# Altium project DUCKF4 V2 - small.PrjPcb
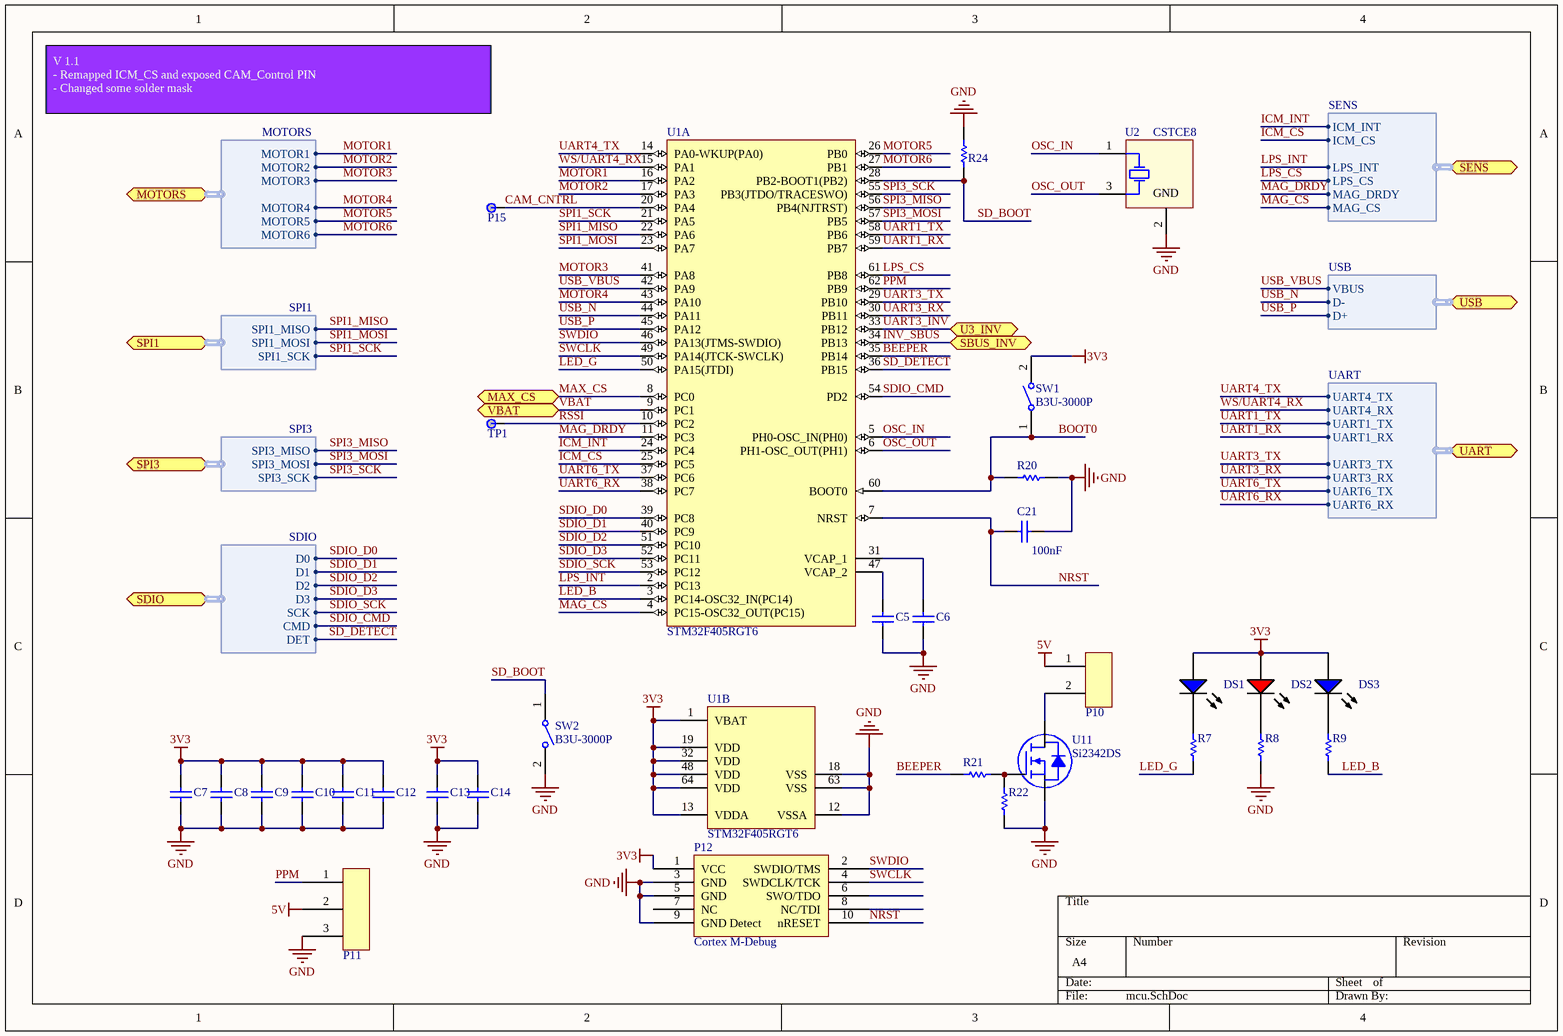
[diagram p0: mcu.SchDoc]
6 sheets, 116 parts. Net scope: flat (ports and power ports of the same name join across sheets).
Sheets:
  mcu.SchDoc
  mems.SchDoc
  powersupply.SchDoc
  connectors.SchDoc
  usd.SchDoc
  osd.SchDoc

## Sheet mcu.SchDoc
size A4

### Parts
C5  CAP 2.2uF 6.3V 0603(1608)  [CAPC0603(1608)100_L]  (value not drawn)
C6  CAP 2.2uF 6.3V 0603(1608)  [CAPC0603(1608)100_L]  (value not drawn)
C7  CAP 100nF 35V 0402(1005)  [CAPC0402(1005)60_L]  (value not drawn)
C8  CAP 100nF 35V 0402(1005)  [CAPC0402(1005)60_L]  (value not drawn)
C9  CAP 100nF 35V 0402(1005)  [CAPC0402(1005)60_L]  (value not drawn)
C10  CAP 100nF 35V 0402(1005)  [CAPC0402(1005)60_L]  (value not drawn)
C11  CAP 100nF 35V 0402(1005)  [CAPC0402(1005)60_L]  (value not drawn)
C12  CAP 4.7uF 6.3V 0603(1608)  [CAPC0603(1608)100_M]  (value not drawn)
C13  CAP 1uF 6.3V 0603(1608)  [CAPC0603(1608)100_N]  (value not drawn)
C14  CAP 10nF 35V 0402(1005)  [CAPC0402(1005)60_M]  (value not drawn)
C21  value 100nF  [CAPC0402(1005)60_L]  (hidden comment: CAP 100nF 35V 0402(1005))
DS1  TLMB1100-GS08  [VISH-TLMX1100-2_V]  (value not drawn)
DS2  TLMS1100-GS08  [VISH-TLMX1100_V]  (value not drawn)
DS3  TLMB1100-GS08  [VISH-TLMX1100-2_V]  (value not drawn)
P10  2 Pads  [2Pads]  (value not drawn)
P11  3 Pads  [3Pads]  (value not drawn)
P12  Cortex M-Debug  [FTSH-105-01-XXX-DV-K]
P15  1Pads  [1PADS]  (value not drawn)  (no BOM)
R7  1K 5% 0402(1005)  [RESC0402(1005)_L]  (value not drawn)
R8  1K 5% 0402(1005)  [RESC0402(1005)_L]  (value not drawn)
R9  1K 5% 0402(1005)  [RESC0402(1005)_L]  (value not drawn)
R20  100K 5% 0402(1005)  [RESC0402(1005)_L]  (value not drawn)
R21  200R 5% 0402(1005)  [RESC0402(1005)_N]  (value not drawn)
R22  110K 5% 0402(1005)  [RESC0402(1005)_L]  (value not drawn)
R24  47K 5% 0402(1005)  [RESC0402(1005)_M]  (value not drawn)
SW1  B3U-3000P  [OMRON-B3U-3000P_V]
SW2  B3U-3000P  [OMRON-B3U-3000P_V]
TP1  Test Point  [TP]  (value not drawn)
U1  STM32F405RGT6  [STM-LQFP64_M]  (parts A,B of 2)
U2  CSTCE8  [MURA-CSTCE_V-3_V]
U11  Si2342DS  [SOT23-3]

### Ports
MAX_CS, MOTORS (harness MOTORS), SBUS_INV, SDIO (harness SDIO), SENS (harness SENS), SPI1 (harness SPI1), SPI3 (harness SPI3), U3_INV, UART (harness UART), USB (harness USB), VBAT

### Harnesses
MOTORS: MOTOR1, MOTOR2, MOTOR3, MOTOR4, MOTOR5, MOTOR6
SPI1: SPI1_MISO, SPI1_MOSI, SPI1_SCK
SPI3: SPI3_MISO, SPI3_MOSI, SPI3_SCK
SDIO: D0, D1, D2, D3, SCK, CMD, DET
USB: VBUS, D-, D+
UART: UART4_TX, UART4_RX, UART1_TX, UART1_RX, UART3_TX, UART3_RX, UART6_TX, UART6_RX
SENS: ICM_INT, ICM_CS, LPS_INT, LPS_CS, MAG_DRDY, MAG_CS

### Nets
3V3: C7.2 C8.2 C9.2 C10.2 C11.2 C12.2 C13.2 C14.2 DS1.1(A) DS2.1(A) DS3.1(A) P12.1(VCC) SW1.2 U1.1(VBAT) U1.13(VDDA) U1.19(VDD) U1.32(VDD) U1.48(VDD) U1.64(VDD)
5V: P10.1 P11.2
GND: C5.1 C6.1 C7.1 C8.1 C9.1 C10.1 C11.1 C12.1 C13.1 C14.1 C21.1 P11.3 P12.3(GND) P12.5(GND) P12.9(GND_Detect) R8.1 R20.2 R22.1 R24.2 SW2.2 U1.12(VSSA) U1.18(VSS) U1.63(VSS) U2.2(GND) U11.2(S)
BEEPER: R21.1 U1.35(PB14)
BOOT0: R20.1 SW1.1 U1.60(BOOT0)
CAM_CNTRL: P15.1 U1.20(PA4)
ICM_CS: U1.25(PC5) ; port SENS.ICM_CS
ICM_INT: U1.24(PC4) ; port SENS.ICM_INT
INV_SBUS: U1.34(PB13) ; port SBUS_INV
LED_B: R9.1 U1.3(PC14-OSC32_IN(PC14))
LED_G: R7.1 U1.50(PA15(JTDI))
LPS_CS: U1.61(PB8) ; port SENS.LPS_CS
LPS_INT: U1.2(PC13) ; port SENS.LPS_INT
MAG_CS: U1.4(PC15-OSC32_OUT(PC15)) ; port SENS.MAG_CS
MAG_DRDY: U1.11(PC3) ; port SENS.MAG_DRDY
MAX_CS: U1.8(PC0) ; port MAX_CS
MOTOR1: U1.16(PA2) ; port MOTORS.MOTOR1
MOTOR2: U1.17(PA3) ; port MOTORS.MOTOR2
MOTOR3: U1.41(PA8) ; port MOTORS.MOTOR3
MOTOR4: U1.43(PA10) ; port MOTORS.MOTOR4
MOTOR5: U1.26(PB0) ; port MOTORS.MOTOR5
MOTOR6: U1.27(PB1) ; port MOTORS.MOTOR6
NRST: C21.2 P12.10(nRESET) U1.7(NRST)
OSC_IN: U1.5(PH0-OSC_IN(PH0)) U2.1(C1)
OSC_OUT: U1.6(PH1-OSC_OUT(PH1)) U2.3(C2)
PPM: P11.1 U1.62(PB9)
RSSI: TP1.1 U1.10(PC2)
SD_BOOT: R24.1 SW2.1 U1.28(PB2-BOOT1(PB2))
SD_DETECT: U1.36(PB15) ; port SDIO.DET
SDIO_CMD: U1.54(PD2) ; port SDIO.CMD
SDIO_D0: U1.39(PC8) ; port SDIO.D0
SDIO_D1: U1.40(PC9) ; port SDIO.D1
SDIO_D2: U1.51(PC10) ; port SDIO.D2
SDIO_D3: U1.52(PC11) ; port SDIO.D3
SDIO_SCK: U1.53(PC12) ; port SDIO.SCK
SPI1_MISO: U1.22(PA6) ; port SPI1.SPI1_MISO
SPI1_MOSI: U1.23(PA7) ; port SPI1.SPI1_MOSI
SPI1_SCK: U1.21(PA5) ; port SPI1.SPI1_SCK
SPI3_MISO: U1.56(PB4(NJTRST)) ; port SPI3.SPI3_MISO
SPI3_MOSI: U1.57(PB5) ; port SPI3.SPI3_MOSI
SPI3_SCK: U1.55(PB3(JTDO/TRACESWO)) ; port SPI3.SPI3_SCK
SWCLK: P12.4(SWDCLK/TCK) U1.49(PA14(JTCK-SWCLK))
SWDIO: P12.2(SWDIO/TMS) U1.46(PA13(JTMS-SWDIO))
UART1_RX: U1.59(PB7) ; port UART.UART1_RX
UART1_TX: U1.58(PB6) ; port UART.UART1_TX
UART3_INV: U1.33(PB12) ; port U3_INV
UART3_RX: U1.30(PB11) ; port UART.UART3_RX
UART3_TX: U1.29(PB10) ; port UART.UART3_TX
UART4_TX: U1.14(PA0-WKUP(PA0)) ; port UART.UART4_TX
UART6_RX: U1.38(PC7) ; port UART.UART6_RX
UART6_TX: U1.37(PC6) ; port UART.UART6_TX
USB_N: U1.44(PA11) ; port USB.D-
USB_P: U1.45(PA12) ; port USB.D+
USB_VBUS: U1.42(PA9) ; port USB.VBUS
VBAT: U1.9(PC1) ; port VBAT
WS/UART4_RX: U1.15(PA1) ; port UART.UART4_RX
NetC5_2: C5.2 U1.47(VCAP_2)
NetC6_2: C6.2 U1.31(VCAP_1)
NetDS1_2: DS1.2(K) R7.2
NetDS2_2: DS2.2(K) R8.2
NetDS3_2: DS3.2(K) R9.2
NetP10_2: P10.2 U11.3(D)
NetR21_2: R21.2 R22.2 U11.1(G)

Not connected (* = marked no-connect by the designer): P12 6(SWO/TDO) 7(NC) 8(NC/TDI)

### Notes on the sheet
- V 1.1
  - Remapped ICM_CS and exposed CAM_Control PIN
  - Changed some solder mask

### Library data of the parts
C5 C6 = CMP-1035-02754-1: CAP 2.2uF 6.3V ±10% 0603 (1608 Metric) Thickness 1mm SMD; Case-EIA: 0603; Tolerance: Â±10%; Case-Metric: 1608; Technology: SMT; Value: 2.2uF; Rated Voltage: 6.3 V; Max Thickness: 1 mm
C7-C11 C21 = CMP-1034-02075-1: CAP 100nF 35V ±10% 0402 (1005 Metric) Thickness 0.6mm SMD; Case-Metric: 1005; Case-EIA: 0402; Tolerance: Â±10%; Max Thickness: 0.6 mm; Technology: SMT; Rated Voltage: 35 V
  C7-C11: Value: 100nF
C12 = CMP-1035-02780-1: CAP 4.7uF 6.3V ±10% 0603 (1608 Metric) Thickness 1mm SMD; Case-Metric: 1608; Case-EIA: 0603; Tolerance: Â±10%; Technology: SMT; Value: 4.7uF; Max Thickness: 1 mm; Rated Voltage: 6.3 V
C13 = CMP-1035-02730-1: CAP 1uF 6.3V ±10% 0603 (1608 Metric) Thickness 1mm SMD; Case-EIA: 0603; Case-Metric: 1608; Tolerance: Â±10%; Rated Voltage: 6.3 V; Max Thickness: 1 mm; Technology: SMT; Value: 1uF
C14 = CMP-1034-01883-1: CAP 10nF 35V ±10% 0402 (1005 Metric) Thickness 0.6mm SMD; Tolerance: Â±10%; Case-Metric: 1005; Case-EIA: 0402; Rated Voltage: 35 V; Technology: SMT; Value: 10nF; Max Thickness: 0.6 mm
DS1 DS3 = CMP-1666-00028-1: Blue LED, 10 mA, 3.9 V, -40 to 100 degC, 2-Pin SMD (0603), RoHS, Tape and Reel; Tolerance: 10%; Voltage Rating: 100 V; Capacitance: 10 nF; Type (Capacitors): X7R; Case\Package: Radial; ComponentLink1Description: Manufacturer URL; REACH SVHC: No SVHC; Package Quantity: 500; PackageDescription: 2-Pin Surface Mount Device, Body 1.6 x 0.8 mm; Pins: 2; ComponentLink2URL: http://download.siliconexpert.com/pdfs/2016/8/7/12/43/26/667/vsh_/manual/379263299541529tlmb1100.pdf; RoHSCompliant: true; Lead Pitch: 2.54 mm; Height: 2.54 mm; DatasheetVersion: Rev. 2.7, 03/2016; Length: 5.33 mm; ComponentLink1URL: http://www.vishay.com/; Min Operating Temperature: -55 degC; PackageReference: 0603; Packaging: Bulk; ComponentLink2Description: Datasheet; Max Operating Temperature: 125 degC; Radiation Hardening: No; Width: 3.81 mm; Mount: Through Hole
DS2 = CMP-1666-00027-1: LED, RED, 2.1 V, -40 to 100 degC, 2-Pin SMD (0603), RoHS, Tape and Reel; Type (Capacitors): C0G; Resistance: 100000000000 Ohm; Capacitance: 12 pF; Voltage Rating: 50 V; Tolerance: 5%; Min Operating Temperature: -55degC; REACH SVHC: No SVHC; ComponentLink2Description: Datasheet; ComponentLink1URL: http://www.vishay.com/; Width: 0.8 mm; Package Quantity: 4000; PackageReference: TLMX1100; ComponentLink2URL: http://www.vishay.com/docs/83173/tlmb1100.pdf; Case/Package: 0603; Case Code (Metric): 1608; Packaging: Tape and Reel; Pins: 2; ComponentLink1Description: Manufacturer URL; Max Operating Temperature: 125degC; Height: 0.8 mm; Length: 1.6 mm; Mount: Surface Mount; PackageDescription: 2-Pin Surface Mount Device, Body 1.6 x 0.8 mm; DatasheetVersion: Rev. 2.7, 03/2016; Case Code (Imperial): 0603; Voltage Rating (DC): 50 V; RoHSCompliant: True; Radiation Hardening: No
P12 = Cortex M Debug: Cortex M-Debug Connector
P15 = Test Point_1: Pad
R7-R9 = CMP-1011-00074-1: 1K 0.063W 5% 0402 (1005 Metric)  SMD; Value: 1000.00 Ohm; Case-EIA: 0402; Case-Metric: 1005; Tolerance: 5 %; Power: 0.063 W; Technology: SMT
R20 = CMP-1011-00122-1: 100K 0.063W 5% 0402 (1005 Metric)  SMD; Value: 100000.00 Ohm; Case-EIA: 0402; Case-Metric: 1005; Power: 0.063 W; Technology: SMT; Tolerance: 5 %
R21 = CMP-1011-00057-1: 200R 0.063W 5% 0402 (1005 Metric)  SMD; Value: 200.00 Ohm; Case-Metric: 1005; Case-EIA: 0402; Power: 0.063 W; Technology: SMT; Tolerance: 5 %
R22 = CMP-1011-00123-1: 110K 0.063W 5% 0402 (1005 Metric)  SMD; Case-Metric: 1005; Value: 110000.00 Ohm; Case-EIA: 0402; Technology: SMT; Tolerance: 5 %; Power: 0.063 W
R24 = CMP-1011-00114-1: 47K 0.063W 5% 0402 (1005 Metric)  SMD; Case-EIA: 0402; Case-Metric: 1005; Value: 47000.00 Ohm; Tolerance: 5 %; Technology: SMT; Power: 0.063 W
SW1 SW2 = CMP-1677-00003-1: Ultra-Small Tactile Switch, 1 to 50 mA, 3 to 12 V, -25 to 70 degC, 2-Pin SMD, RoHS, Tape and Reel; Tolerance: 20%; Voltage Rating (DC): 50 V; Capacitance: 470 uF; Case\Package: Radial; PackageReference: B3U-3000P; Min Operating Temperature: -40 degC; Length: 20 mm; Mount: Through Hole; ComponentLink2Description: Datasheet; RoHSCompliant: true; ComponentLink1URL: http://www.omron.com/; Package Quantity: 200; Radiation Hardening: No; Height: 20 mm; ComponentLink2URL: https://www.omron.com/ecb/products/pdf/en-b3u.pdf; Diameter: 10 mm; Max Operating Temperature: 85 degC; Lead Pitch: 5 mm; DatasheetVersion: Jan-15; Packaging: Bulk; PackageDescription: 2-Pin Surface Mount Device, Body 4 x 3.2 mm; Voltage Rating: 50 V; Pins: 2; ComponentLink1Description: Manufacturer URL; REACH SVHC: No SVHC
U1 = CMP-0243-00019-3: ARM Cortex-M4 32-bit MCU+FPU, 210 DMIPS, 1024 kB Flash, 192 kB Internal RAM, 51 I/Os, 64-pin LQFP, -40 to 85 degC, Tray; Manufacturer: STMicroelectronics; Supply Voltage(Vcc) min (V): 1.8; Supply Voltage(Vcc) max (V): 3.6; Internal RAM Size (kB): 192; I/Os (High Current): 51; D/A Converter: 2x12-bit; FLASH Size (Prog) (kB): 1024; Operating Frequency(F) (Processor speed) (MHz): 168; ComponentLink2Description: Datasheet; PackageVersion: Rev. 4, 06/2013; DatasheetVersion: Rev. 4; Core: ARM Cortex-M4; ComponentLink2URL: http://www.st.com/st-web-ui/static/active/en/resource/technical/document/datasheet/DM00037051.pdf; PackageReference: LQFP64; Packing: Tray; ComponentLink1Description: Manufacturer URL; ComponentLink3URL: http://www.st.com/st-web-ui/static/active/en/resource/technical/document/datasheet/DM00037051.pdf; ComponentLink3Description: Package Specification; Mounting Technology: Surface Mount; ComponentLink1URL: http://www.st.com/web/en/home.html; PackageDescription: 64-Pin Low Profile Quad Flat Package, 10 x 10 mm Body, 0.5 mm Pitch; PartNumber: STM32F405RGT6
U2 = CMP-0588-00001-2: Ceramic Resonator, 16 MHz with Built-in Capacitance, Thickness Expander Mode, Initial Frequency Tolerance +/- 0.5%, Load Capacity 15 pF, -20 to 80 degC, 3.2 x 1.3 x 1 mm SMD, RoHS, Reel; Manufacturer: Murata; Oscillating Frequency: 16 MHz; Load Capacity: 15 pF; PackageDescription: 3-Pin SMD, Body 3.2 x 1.3 mm, Pitch 0.95 mm; Mounting Technology: Surface Mount; ComponentLink1URL: http://www.murata.com/; RoHS: TRUE; Packing: Reel; Initial Frequency Tolerance: +/- 0.5%; PartNumber: CSTCE8; ComponentLink2Description: Datasheet; DatasheetVersion: Rev. P16E-22; PackageReference: CSTCE_V-3; Operating Temperature Range: -20 to 80 degC; ComponentLink2URL: http://www.murata.com/products/catalog/pdf/p16e.pdf; ComponentLink1Description: Manufacturer URL; Initial Tolerance: +/- 0.5%
U11 = Si2342DS: N Channel MOSFET

## Sheet mems.SchDoc
size A4
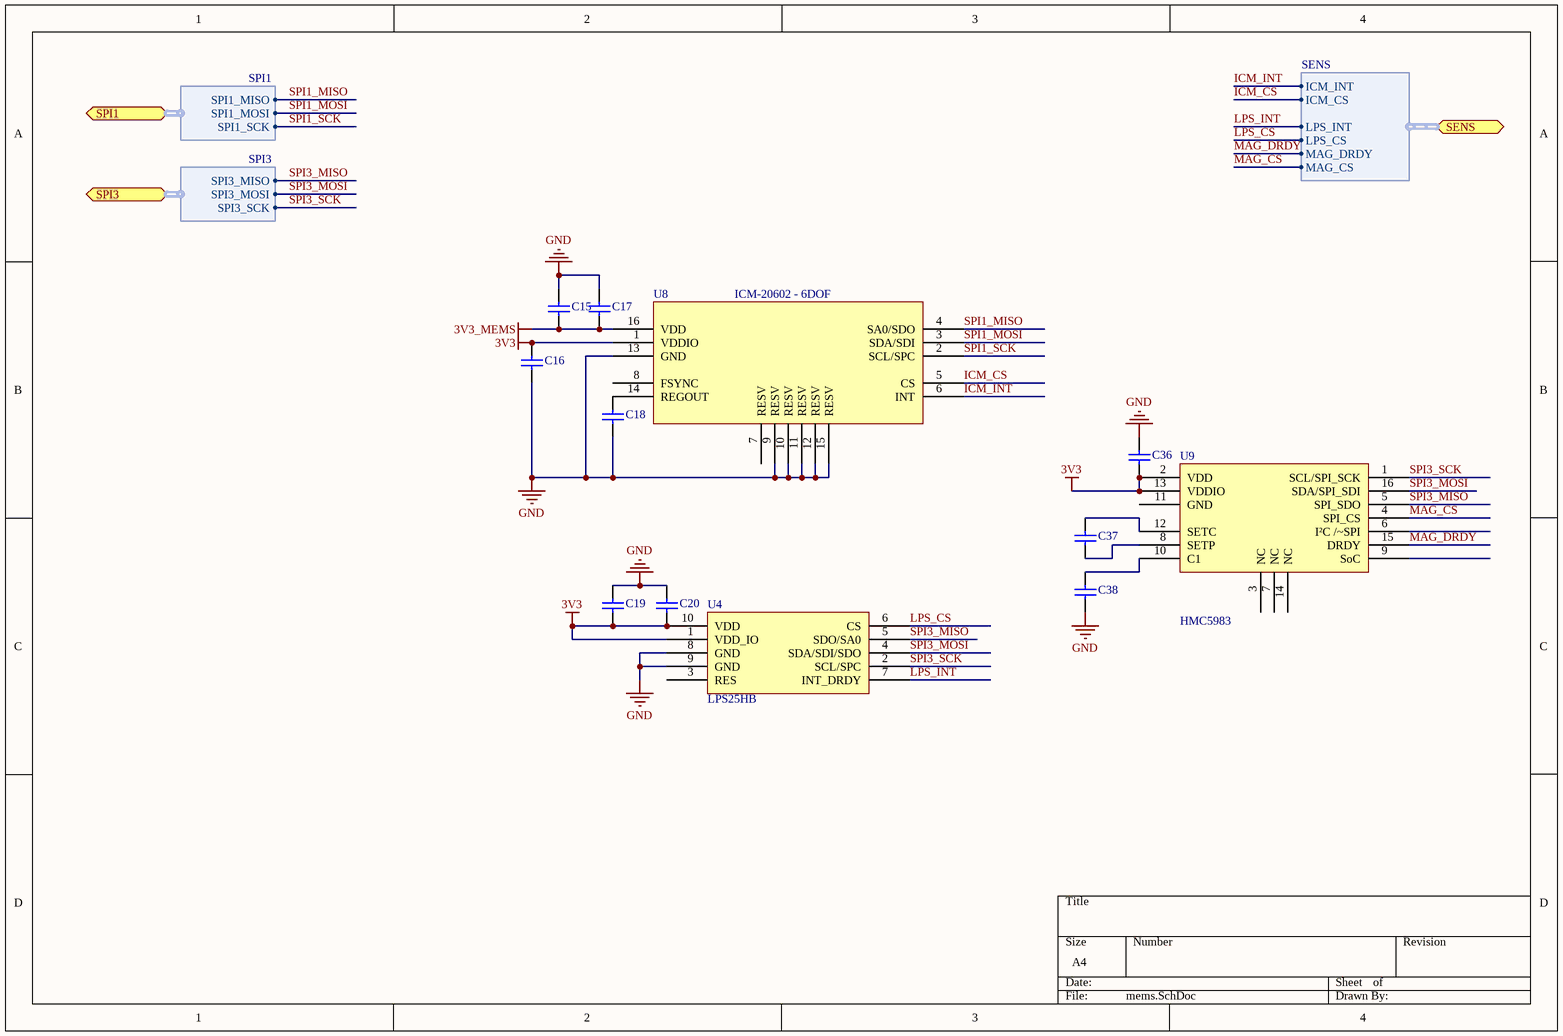
[diagram p1: mems.SchDoc]

### Parts
C15  CAP 100nF 35V 0402(1005)  [CAPC0402(1005)60_M]  (value not drawn)
C16  CAP 10nF 35V 0402(1005)  [CAPC0402(1005)60_M]  (value not drawn)
C17  CAP 2.2uF 16V 0603(1608)  [CAPC0603(1608)55_L]  (value not drawn)
C18  CAP 100nF 25V 0402(1005)  [CAPC0402(1005)60_L]  (value not drawn)
C19  CAP 1uF 6.3V 0603(1608)  [CAPC0603(1608)100_L]  (value not drawn)
C20  CAP 100nF 35V 0402(1005)  [CAPC0402(1005)60_L]  (value not drawn)
C36  CAP 100nF 35V 0402(1005)  [CAPC0402(1005)60_L]  (value not drawn)
C37  CAP 220nF 25V 0402(1005)  [CAPC0402(1005)60_L]  (value not drawn)
C38  CAP 4.7uF 16V 0603(1608)  [CAPC0603(1608)100_L]  (value not drawn)
U4  LPS25HB  [HLGA10]
U8  ICM-20602 - 6DOF  [LCC16]
U9  HMC5983  [LCC16]

### Ports
SENS (harness SENS), SPI1 (harness SPI1), SPI3 (harness SPI3)

### Harnesses
SPI1: SPI1_MISO, SPI1_MOSI, SPI1_SCK
SENS: ICM_INT, ICM_CS, LPS_INT, LPS_CS, MAG_DRDY, MAG_CS
SPI3: SPI3_MISO, SPI3_MOSI, SPI3_SCK

### Nets
3V3: C16.2 C19.1 C20.1 C36.1 U4.1(VDD_IO) U4.10(VDD) U8.1(VDDIO) U9.2(VDD) U9.13(VDDIO)
3V3_MEMS: C15.1 C17.1 U8.16(VDD)
GND: C15.2 C16.1 C17.2 C18.1 C19.2 C20.2 C36.2 C38.1 U4.8(GND) U4.9(GND) U8.9(RESV) U8.10(RESV) U8.11(RESV) U8.12(RESV) U8.13(GND) U8.15(RESV)
ICM_CS: U8.5(CS) ; port SENS.ICM_CS
ICM_INT: U8.6(INT) ; port SENS.ICM_INT
LPS_CS: U4.6(CS) ; port SENS.LPS_CS
LPS_INT: U4.7(INT_DRDY) ; port SENS.LPS_INT
MAG_CS: U9.4(SPI_CS) ; port SENS.MAG_CS
MAG_DRDY: U9.15(DRDY) ; port SENS.MAG_DRDY
SPI1_MISO: U8.4(SA0/SDO) ; port SPI1.SPI1_MISO
SPI1_MOSI: U8.3(SDA/SDI) ; port SPI1.SPI1_MOSI
SPI1_SCK: U8.2(SCL/SPC) ; port SPI1.SPI1_SCK
SPI3_MISO: U4.5(SDO/SA0) U9.5(SPI_SDO) ; port SPI3.SPI3_MISO
SPI3_MOSI: U4.4(SDA/SDI/SDO) U9.16(SDA/SPI_SDI) ; port SPI3.SPI3_MOSI
SPI3_SCK: U4.2(SCL/SPC) U9.1(SCL/SPI_SCK) ; port SPI3.SPI3_SCK
NetC18_2: C18.2 U8.14(REGOUT)
NetC37_1: C37.1 U9.12(SETC)
NetC37_2: C37.2 U9.8(SETP)
NetC38_2: C38.2 U9.10(C1)

Not connected (* = marked no-connect by the designer): U4 3(RES); U8 7(RESV) 8(FSYNC); U9 3(NC) 6(I²C_/~SPI) 7(NC) 9(SoC) 11(GND) 14(NC)

### Library data of the parts
C15 C20 C36 = CMP-1034-02075-1: as C7 on sheet mcu; Max Thickness: 0.6 mm; Value: 100nF; Technology: SMT; Rated Voltage: 35 V
C16 = CMP-1034-01883-1: as C14 on sheet mcu; Rated Voltage: 35 V; Technology: SMT; Value: 10nF; Max Thickness: 0.6 mm
C17 = CMP-1035-02764-1: CAP 2.2uF 16V ±20% 0603 (1608 Metric) Thickness 0.55mm SMD; Tolerance: Â±20%; Case-Metric: 1608; Case-EIA: 0603; Value: 2.2uF; Rated Voltage: 16 V; Max Thickness: 0.55 mm; Technology: SMT
C18 = CMP-1034-02073-1: CAP 100nF 25V ±20% 0402 (1005 Metric) Thickness 0.6mm SMD; Tolerance: Â±20%; Case-EIA: 0402; Case-Metric: 1005; Rated Voltage: 25 V; Value: 100nF; Max Thickness: 0.6 mm; Technology: SMT
C19 = CMP-1035-02731-1: CAP 1uF 6.3V ±20% 0603 (1608 Metric) Thickness 1mm SMD; Case-EIA: 0603; Tolerance: Â±20%; Case-Metric: 1608; Value: 1uF; Technology: SMT; Max Thickness: 1 mm; Rated Voltage: 6.3 V
C37 = CMP-1034-02093-1: CAP 220nF 25V ±20% 0402 (1005 Metric) Thickness 0.6mm SMD; Case-EIA: 0402; Case-Metric: 1005; Tolerance: Â±20%; Rated Voltage: 25 V; Value: 220nF; Technology: SMT; Max Thickness: 0.6 mm
C38 = CMP-1035-02789-1: CAP 4.7uF 16V ±20% 0603 (1608 Metric) Thickness 1mm SMD; Case-EIA: 0603; Tolerance: Â±20%; Case-Metric: 1608; Max Thickness: 1 mm; Rated Voltage: 16 V; Technology: SMT; Value: 4.7uF
U8 = ICM-20602
U9 = HMC5983: HMC5983 - 3 axis Compass

## Sheet powersupply.SchDoc
size A4
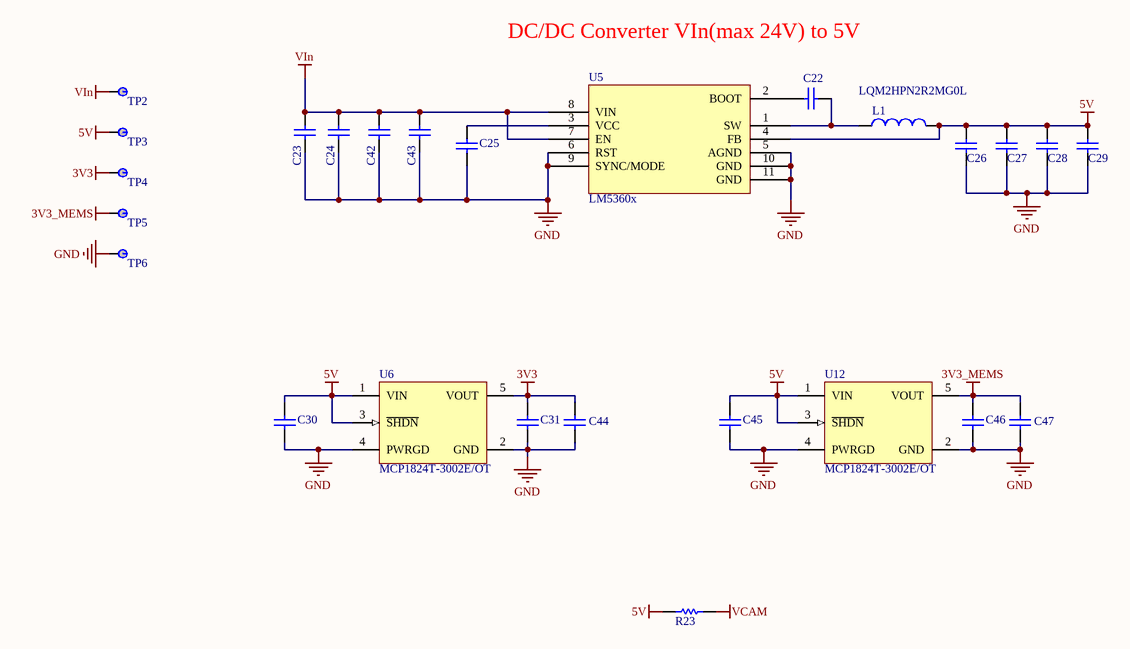
[diagram p2: powersupply.SchDoc]

### Parts
C22  CAP 100nF 50V 0805(2012)  [CAPC0805(2012)100_M]  (value not drawn)
C23  CAP 4.7uF 50V 0805(2012)  [CAPC0805(2012)145_M]  (value not drawn)
C24  CAP 100nF 50V 0805(2012)  [CAPC0805(2012)100_M]  (value not drawn)
C25  CAP 1uF 6.3V 0603(1608)  [CAPC0603(1608)100_N]  (value not drawn)
C26  CAP 4.7uF 16V 0603(1608)  [CAPC0603(1608)100_N]  (value not drawn)
C27  CAP 4.7uF 16V 0603(1608)  [CAPC0603(1608)100_N]  (value not drawn)
C28  CAP 4.7uF 16V 0603(1608)  [CAPC0603(1608)100_N]  (value not drawn)
C29  CAP 4.7uF 16V 0603(1608)  [CAPC0603(1608)100_N]  (value not drawn)
C30  CAP 1uF 35V 0603(1608)  [CAPC0603(1608)100_L]  (value not drawn)
C31  CAP 1uF 35V 0603(1608)  [CAPC0603(1608)100_L]  (value not drawn)
C42  CAP 4.7uF 50V 1210(3225)  [CAPC1210(3225)280_L]  (value not drawn)
C43  CAP 4.7uF 50V 1210(3225)  [CAPC1210(3225)280_L]  (value not drawn)
C44  CAP 4.7uF 16V 0603(1608)  [CAPC0603(1608)100_L]  (value not drawn)
C45  CAP 1uF 35V 0603(1608)  [CAPC0603(1608)100_L]  (value not drawn)
C46  CAP 1uF 35V 0603(1608)  [CAPC0603(1608)100_L]  (value not drawn)
C47  CAP 4.7uF 16V 0603(1608)  [CAPC0603(1608)100_L]  (value not drawn)
L1  LQM2HPN2R2MG0L  [INDC2520X100X60ML20T20]
R23  Jumper 1206(3216)  [RESC1206(3216)_L]  (value not drawn)
TP2  Test Point  [TP]  (value not drawn)  (no BOM)
TP3  Test Point  [TP]  (value not drawn)  (no BOM)
TP4  Test Point  [TP]  (value not drawn)  (no BOM)
TP5  Test Point  [TP]  (value not drawn)  (no BOM)
TP6  Test Point  [TP]  (value not drawn)  (no BOM)
U5  LM5360x  [TI WSON-10 SD]
U6  MCP1824T-3002E/OT  [SOT-23-OT5_L]
U12  MCP1824T-3002E/OT  [SOT-23-OT5_L]

### Nets
3V3: C31.2 C44.2 TP4.1 U6.5(VOUT)
3V3_MEMS: C46.2 C47.2 TP5.1 U12.5(VOUT)
5V: C26.2 C27.2 C28.2 C29.2 C30.2 C45.2 L1.2 R23.1 TP3.1 U5.4(FB) U6.1(VIN) U6.3(~{SHDN}) U12.1(VIN) U12.3(~{SHDN})
GND: C23.1 C24.2 C25.1 C26.1 C27.1 C28.1 C29.1 C30.1 C31.1 C42.1 C43.1 C44.1 C45.1 C46.1 C47.1 TP6.1 U5.5(AGND) U5.6(RST) U5.9(SYNC/MODE) U5.10(GND) U5.11(GND) U6.2(GND) U6.4(PWRGD) U12.2(GND) U12.4(PWRGD)
VCAM: R23.2
VIn: C23.2 C24.1 C42.2 C43.2 TP2.1 U5.7(EN) U5.8(VIN)
NetC22_1: C22.1 U5.2(BOOT)
NetC22_2: C22.2 L1.1 U5.1(SW)
NetC25_2: C25.2 U5.3(VCC)

### Notes on the sheet
- DC/DC Converter VIn(max 24V) to 5V

### Library data of the parts
C22 C24 = CMP-1036-04420-1: CAP 100nF 50V ±10% 0805 (2012 Metric) Thickness 1mm SMD; Case-EIA: 0805; Tolerance: Â±10%; Case-Metric: 2012; Rated Voltage: 50 V; Value: 100nF; Max Thickness: 1 mm; Technology: SMT
C23 = CMP-1036-04901-1: CAP 4.7uF 50V ±20% 0805 (2012 Metric) Thickness 1.45mm SMD; Tolerance: Â±20%; Case-Metric: 2012; Case-EIA: 0805; Technology: SMT; Value: 4.7uF; Max Thickness: 1.45 mm; Rated Voltage: 50 V
C25 = CMP-1035-02730-1: as C13 on sheet mcu; Rated Voltage: 6.3 V; Max Thickness: 1 mm; Technology: SMT; Value: 1uF
C26-C29 C44 C47 = CMP-1035-02789-1: as C38 on sheet mems; Max Thickness: 1 mm; Rated Voltage: 16 V; Technology: SMT; Value: 4.7uF
C30 C31 C45 C46 = CMP-1035-02743-1: CAP 1uF 35V ±10% 0603 (1608 Metric) Thickness 1mm SMD; Case-Metric: 1608; Case-EIA: 0603; Tolerance: Â±10%; Max Thickness: 1 mm; Value: 1uF; Technology: SMT; Rated Voltage: 35 V
C42 C43 = CMP-1038-02162-1: CAP 4.7uF 50V ±10% 1210 (3225 Metric) Thickness 2.8mm SMD; Case-Metric: 3225; Case-EIA: 1210; Tolerance: Â±10%; Rated Voltage: 50 V; Technology: SMT; Max Thickness: 2.8 mm; Value: 4.7uF
L1 = CMP-1662-00028-1: Chip Inductor, 2.2 uH, +/- 20%, -55 to 125 degC, 1008 (2520 Metric), RoHS, Tape and Reel; Voltage Rating (DC): 50 V; Capacitance: 220 uF; Case\Package: Radial; Lead Pitch: 5 mm; PackageDescription: 2-Pin Surface Mounted Device, Body 2.5 x 2 mm; ComponentLink2URL: http://psearch.en.murata.com/inductor/product/LQM2HPN2R2MG0%23.pdf; Height: 12.5 mm; PackageReference: 1008; Voltage Rating: 50 V; ComponentLink1URL: http://www.murata.com/; Package Quantity: 200; REACH SVHC: No SVHC; ComponentLink1Description: Manufacturer URL; Length: 12.5 mm; Max Operating Temperature: 85 degC; DatasheetVersion: Aug-16; Diameter: 10 mm; RoHSCompliant: true; Packaging: Bulk; Mount: Through Hole; Pins: 2; ComponentLink2Description: Datasheet; Tolerance: 20%; Min Operating Temperature: -40 degC; Radiation Hardening: No
R23 = CMP-1014-00001-1: Jumper 1206 (3216 Metric); Tolerance: None; Case-EIA: 1206; Case-Metric: 3216; Value: 0.00 Ohm; Technology: SMT; Power: None
U6 U12 = CMP-0136-00662-1: 300 mA, Low Voltage, Low Quiescent Current LDO Regulator, 5-Pin SOT-23, Extended Temperature, Tape and Reel; Code_IPC: SOT23-5; PackageDescription: 5-Lead Plastic Small Outline Transistor (OT) [SOT-23]; PackageVersion: revBB, Aug-2009; PackageReference: SOT-23-OT5; DatasheetVersion: revA, Aug-2007

## Sheet connectors.SchDoc
size A4
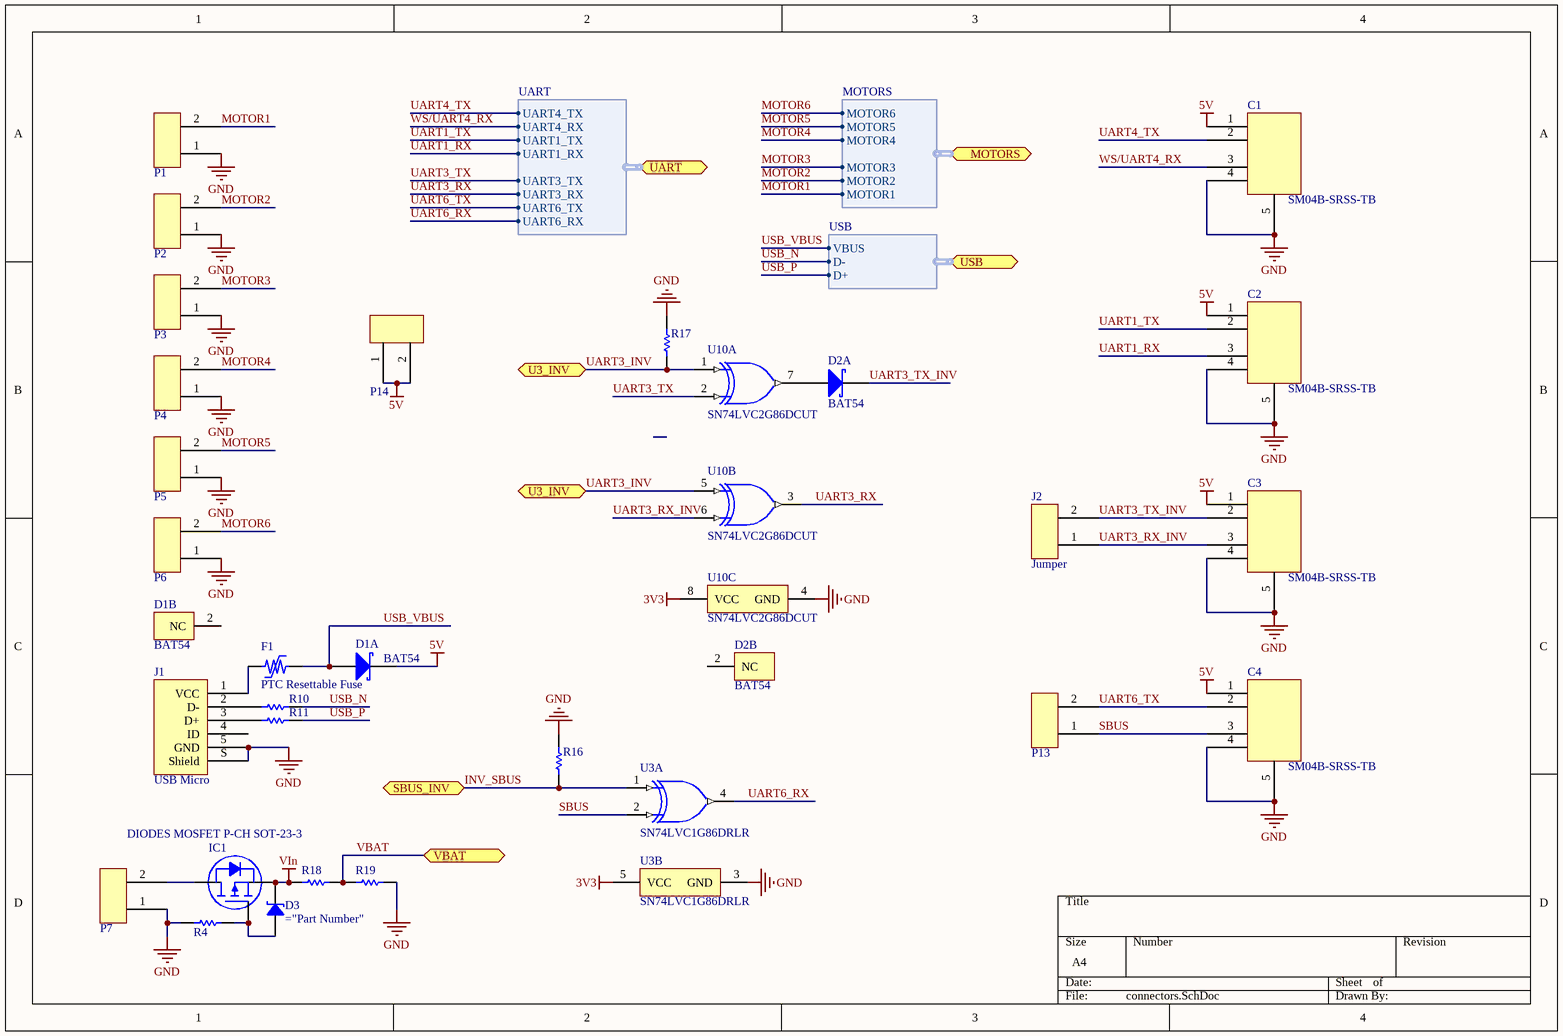
[diagram p3: connectors.SchDoc]

### Parts
C1  SM04B-SRSS-TB  [SM04B-SRSS-TB]
C2  SM04B-SRSS-TB  [SM04B-SRSS-TB]
C3  SM04B-SRSS-TB  [SM04B-SRSS-TB]
C4  SM04B-SRSS-TB  [SM04B-SRSS-TB]
D1  BAT54  [NXP-SOT23-3_V]  (parts A,B of 2)
D2  BAT54  [NXP-SOT23-3_V]  (parts A,B of 2)
D3  (no value)  [SOD-123]
F1  PTC Resettable Fuse  [F0805]
IC1  DIODES MOSFET P-CH SOT-23-3  [DIODES SOT-23-3]
J1  USB Micro  [FCI USB 10118193-0001LF]
J2  Jumper  [Jumper]
P1  2Pads  [2Pads]  (value not drawn)
P2  2Pads  [2Pads]  (value not drawn)
P3  2Pads  [2Pads]  (value not drawn)
P4  2Pads  [2Pads]  (value not drawn)
P5  2Pads  [2Pads]  (value not drawn)
P6  2Pads  [2Pads]  (value not drawn)
P7  2Pads  [2Pads]  (value not drawn)
P13  2 Pads  [2Pads]  (value not drawn)
P14  2 Pads  [2Pads]  (value not drawn)
R4  100K 5% 0402(1005)  [RESC0402(1005)_L]  (value not drawn)
R10  22R 5% 0402(1005)  [RESC0402(1005)_M]  (value not drawn)
R11  22R 5% 0402(1005)  [RESC0402(1005)_M]  (value not drawn)
R16  10K 5% 0402(1005)  [RESC0402(1005)_L]  (value not drawn)
R17  10K 5% 0402(1005)  [RESC0402(1005)_L]  (value not drawn)
R18  10K 5% 0402(1005)  [RESC0402(1005)_L]  (value not drawn)
R19  1K 5% 0402(1005)  [RESC0402(1005)_L]  (value not drawn)
U3  SN74LVC1G86DRLR  [DRL0005A_M]  (parts A,B of 2)
U10  SN74LVC2G86DCUT  [DCU0008A_M]  (parts A,B,C of 3)

### Ports
MOTORS (harness MOTORS), SBUS_INV, U3_INV, UART (harness UART), USB (harness USB), VBAT

### Harnesses
USB: VBUS, D-, D+
MOTORS: MOTOR1, MOTOR2, MOTOR3, MOTOR4, MOTOR5, MOTOR6
UART: UART4_TX, UART4_RX, UART1_TX, UART1_RX, UART3_TX, UART3_RX, UART6_TX, UART6_RX

### Nets
3V3: U3.5(VCC) U10.8(VCC)
5V: C1.1 C2.1 C3.1 C4.1 D1.3(K) P14.1 P14.2
GND: C1.4 C1.5 C2.4 C2.5 C3.4 C3.5 C4.4 C4.5 J1.5(GND) J1.S(Shield) P1.1 P2.1 P3.1 P4.1 P5.1 P6.1 P7.1 R4.1 R16.2 R17.2 R19.2 U3.3(GND) U10.4(GND)
VIn: D3.2 IC1.3(S) R18.1
INV_SBUS: R16.1 U3.1(A) ; port SBUS_INV
MOTOR1: P1.2 ; port MOTORS.MOTOR1
MOTOR2: P2.2 ; port MOTORS.MOTOR2
MOTOR3: P3.2 ; port MOTORS.MOTOR3
MOTOR4: P4.2 ; port MOTORS.MOTOR4
MOTOR5: P5.2 ; port MOTORS.MOTOR5
MOTOR6: P6.2 ; port MOTORS.MOTOR6
SBUS: C4.3 P13.1 U3.2(B)
UART1_RX: C2.3 ; port UART.UART1_RX
UART1_TX: C2.2 ; port UART.UART1_TX
UART3_INV: R17.1 U10.1(1A) U10.5(2A) ; port U3_INV
UART3_RX: U10.3(2Y) ; port UART.UART3_RX
UART3_RX_INV: C3.3 J2.1 U10.6(2B)
UART3_TX: U10.2(1B) ; port UART.UART3_TX
UART3_TX_INV: C3.2 D2.3(K) J2.2
UART4_TX: C1.2 ; port UART.UART4_TX
UART6_RX: U3.4(Y) ; port UART.UART6_RX
UART6_TX: C4.2 P13.2 ; port UART.UART6_TX
USB_N: R10.2 ; port USB.D-
USB_P: R11.2 ; port USB.D+
USB_VBUS: D1.1(A) F1.2 ; port USB.VBUS
VBAT: R18.2 R19.1 ; port VBAT
WS/UART4_RX: C1.3 ; port UART.UART4_RX
NetD2_1: D2.1(A) U10.7(1Y)
NetD3_1: D3.1 IC1.1(G) R4.2
NetF1_1: F1.1 J1.1(VCC)
NetIC1_2: IC1.2(D) P7.2
NetJ1_2: J1.2(D-) R10.1
NetJ1_3: J1.3(D+) R11.1

Not connected (* = marked no-connect by the designer): D1 2(NC); D2 2(NC); J1 4(ID)

### Library data of the parts
C1-C4 = SM04B-SRSS-TB: JST SH 4-Pin Side Entry Housing
D1 D2 = CMP-0417-00004-1: Schottky Barrier Diode, 30 V, 2 uA, -55 to 150 degC, 3-Pin SOT23, RoHS, Tape and Reel; Manufacturer: NXP Semiconductors; Cd (pF): 10; Rth(j-a) (K/W): 500; VF (mV): 800; Trr (ns): 5; IR (uA): 2; VR (V): 30; DatasheetVersion: Rev. 5; Mounting Technology: Surface Mount; Temperature Range: -55 to 150 degC; Packing: Tape and Reel; PartNumber: BAT54; ComponentLink2Description: Datasheet; PackageReference: SOT23-3; ComponentLink2URL: http://www.nxp.com/documents/data_sheet/BAT54_SER.pdf; RoHS: TRUE; ComponentLink1Description: Manufacturer URL; PackageDescription: 3-Pin Plastic Surface-mounted Package, Body 1.3 x 2.9 mm, Pitch 0.95 mm; ComponentLink1URL: http://www.nxp.com/
D3 = Diode Zener: Zener Diode
F1 = PPTC: MF-PSMF Series - PTC Resettable Fuses; Manufacturer: Bourns; Voltage Rating (DC): 6V; Max Current Rating: 100A; Power Dissipation: 800mW; Resistance: 150mOhm; Package Quantity: 2000; Voltage Rating: 6V; RoHSCompliant: true; Contact Plating: Gold; REACH SVHC: NoSVHC; Datasheet URL: http://www.bourns.com/docs/Product-Datasheets/mfmsmf.pdf; Lead Free: LeadFree; Height: 0.85mm; Min Operating Temperature: -40degC; Case Code (Metric): 4532; Number of Terminals: 2; Case Code (Imperial): 1812; Case/Package: 1812; Current Rating: 100A; Length: 4.73mm; Max Operating Temperature: 85degC; Package Reference: MF-MSMF050-2; Radiation Hardening: No; Datasheet Version: Rev. AG, 08/2016; Packaging: TapeandReel; Termination: SMD/SMT; Supply Voltage: 6V; Manufacturer URL: http://www.bourns.com/; Mount: SurfaceMount; Package Description: 2-Pin Surface Mount Device, Body 4.55 x 3.24 mm
J1 = USB 2.0 Type B Micro
J2 = PCB Jumper
R4 = CMP-1011-00122-1: as R20 on sheet mcu; Power: 0.063 W; Technology: SMT; Tolerance: 5 %
R10 R11 = CMP-1011-00034-1: 22R 0.063W 5% 0402 (1005 Metric)  SMD; Value: 22.00 Ohm; Case-EIA: 0402; Case-Metric: 1005; Power: 0.063 W; Tolerance: 5 %; Technology: SMT
R16-R18 = CMP-1011-00098-1: 10K 0.063W 5% 0402 (1005 Metric)  SMD; Case-Metric: 1005; Value: 10000.00 Ohm; Case-EIA: 0402; Technology: SMT; Tolerance: 5 %; Power: 0.063 W
R19 = CMP-1011-00074-1: as R7 on sheet mcu; Tolerance: 5 %; Power: 0.063 W; Technology: SMT
U3 = CMP-0859-00794-3: Single 2-Input Exclusive-OR Gate, DRL0005A, LARGE T&R; Manufacturer: Texas Instruments; ICC @ Nom Voltage(Max)(mA): 0.01; Sub-Family: XOR Gate; VCC(Max)(V): 5.5; Output Drive (IOL/IOH)(Max)(mA): 32/-32; Technology Family: LVC; Voltage(Nom)(V): 1.8,2.5,3.3,5; VCC(Min)(V): 1.65; 3-State Output: No; Input Type: CMOS/TTL; Bits(#): 1; tpd @ Nom Voltage(Max)(ns): 9.9,5.5,5,4; Output Type: CMOS; Logic: True; Rating: Catalog; Gate Type: XOR; F @ Nom Voltage(Max)(Mhz): 150; Operating Temperature Range(C): -40 to 125,-40 to 85; DatasheetVersion: SCES222O; Generic Part Number: SN74LVC1G86; PackageReference: DRL0005A; Schmitt Trigger: No
U10 = CMP-0859-00611-3: Dual 2-Input Exclusive-Or Gate, DCU0008A, SMALL T&R; Manufacturer: Texas Instruments; Technology Family: LVC; Bits(#): 2; Voltage(Nom)(V): 1.8,2.5,3.3,5; VCC(Min)(V): 1.65; Schmitt Trigger: No; VCC(Max)(V): 5.5; Sub-Family: XOR Gate; Input Type: CMOS/TTL; Output Drive (IOL/IOH)(Max)(mA): 32/-32; F @ Nom Voltage(Max)(Mhz): 150; Rating: Catalog; ICC @ Nom Voltage(Max)(mA): 0.01; Logic: True; Output Type: CMOS; tpd @ Nom Voltage(Max)(ns): 11,6.7,5.6,4.2; PackageReference: DCU0008A; Generic Part Number: SN74LVC2G86; 3-State Output: No; DatasheetVersion: SCES360I; Operating Temperature Range(C): -40 to 125,-40 to 85

## Sheet usd.SchDoc
size A4
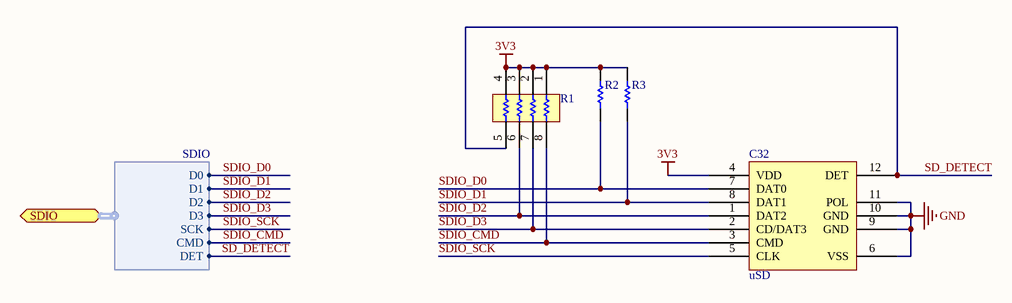
[diagram p4: usd.SchDoc]

### Parts
C32  uSD  [47309-XXX 3.35mm]
R1  CAY16-103J4LF  [BOUR-CAY16-J4_V]  (value not drawn)
R2  47K 5% 0402(1005)  [RESC0402(1005)_M]  (value not drawn)
R3  47K 5% 0402(1005)  [RESC0402(1005)_M]  (value not drawn)

### Ports
SDIO (harness SDIO)

### Harnesses
SDIO: D0, D1, D2, D3, SCK, CMD, DET

### Nets
3V3: C32.4(VDD) R1.1 R1.2 R1.3 R1.4 R2.2 R3.2
GND: C32.6(VSS) C32.9(GND) C32.10(GND) C32.11(POL)
SD_DETECT: C32.12(DET) R1.5 ; port SDIO.DET
SDIO_CMD: C32.3(CMD) R1.8 ; port SDIO.CMD
SDIO_D0: C32.7(DAT0) R2.1 ; port SDIO.D0
SDIO_D1: C32.8(DAT1) R3.1 ; port SDIO.D1
SDIO_D2: C32.1(DAT2) R1.6 ; port SDIO.D2
SDIO_D3: C32.2(CD/DAT3) R1.7 ; port SDIO.D3
SDIO_SCK: C32.5(CLK) ; port SDIO.SCK

### Library data of the parts
C32 = 47309-XXX: molex MICROSD/MICROSIM Connector
R1 = CMP-1747-00005-1: Chip Resistor Array, 10 KOhm, +/- 5%, 62.5 mW, -55 to 125 degC, 8-Pin SMD, RoHS, Tape and Reel; Power Rating: 100 mW; Case\Package: 0603; Voltage Rating: 75 V; Tolerance: 1%; Resistance: 220 Ohm; Packaging: Tape and Reel; Min Operating Temperature: -55 degC; Pins: 2; Radiation Hardening: No; DatasheetVersion: Jan-15; Length: 0.063 inch; RoHSCompliant: true; Mount: Surface Mount; ComponentLink1Description: Manufacturer URL; ComponentLink1URL: http://www.bourns.com/; Weight: 7.1E-05 oz; ComponentLink2URL: http://www.bourns.com/docs/Product-Datasheets/CATCAY.pdf; PackageReference: CAY16-J4; Width: 0.031 inch; Case Code (Imperial): 0603; Case Code (Metric): 1608; REACH SVHC: Yes; Max Operating Temperature: 155 degC; ComponentLink2Description: Datasheet; Height: 0.022 inch; PackageDescription: 8-Pin Surface Mount Device, Body 1.6 x 3.2 mm, Pitch 0.8 mm
R2 R3 = CMP-1011-00114-1: as R24 on sheet mcu; Tolerance: 5 %; Technology: SMT; Power: 0.063 W

## Sheet osd.SchDoc
size A4
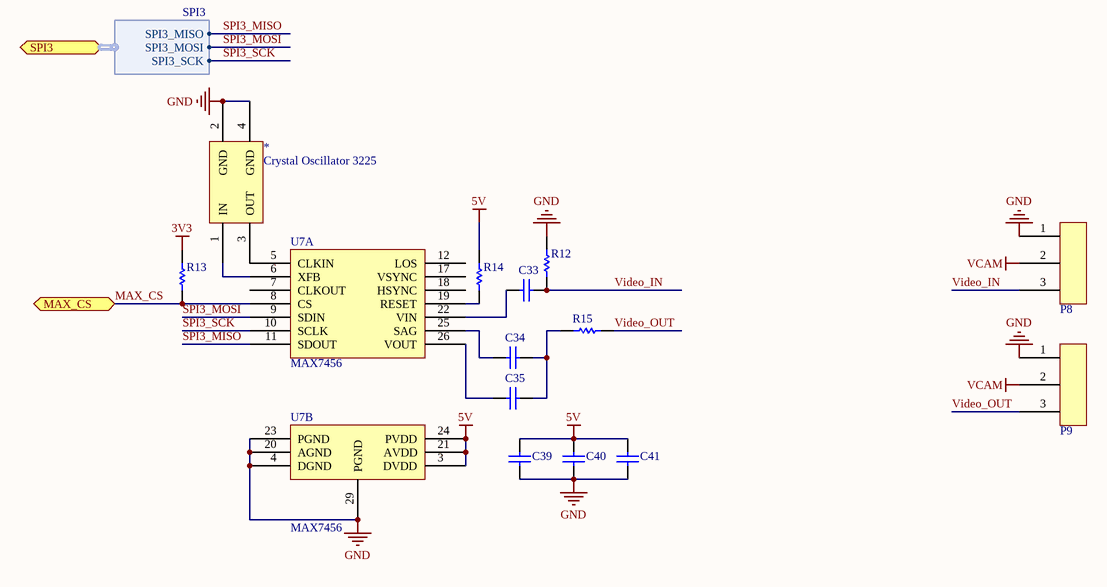
[diagram p5: osd.SchDoc]

### Parts
*  Crystal Oscillator 3225  [TSX-3225]
C33  CAP 100nF 25V 0603(1608)  [CAPC0603(1608)100_N]  (value not drawn)
C34  CAP 47uF 16V 1206(3216)  [CAPC1206(3216)190_M]  (value not drawn)
C35  CAP 47uF 16V 1206(3216)  [CAPC1206(3216)190_M]  (value not drawn)
C39  CAP 100nF 35V 0402(1005)  [CAPC0402(1005)60_L]  (value not drawn)
C40  CAP 100nF 35V 0402(1005)  [CAPC0402(1005)60_L]  (value not drawn)
C41  CAP 100nF 35V 0402(1005)  [CAPC0402(1005)60_L]  (value not drawn)
P8  3 Pads  [3Pads]  (value not drawn)
P9  3 Pads  [3Pads]  (value not drawn)
R12  75R 5% 0603(1608)  [RESC0603(1608)_N]  (value not drawn)
R13  10K 5% 0402(1005)  [RESC0402(1005)_N]  (value not drawn)
R14  10K 5% 0402(1005)  [RESC0402(1005)_L]  (value not drawn)
R15  75R 5% 0402(1005)  [RESC0402(1005)_L]  (value not drawn)
U7  MAX7456  [SOP28]  (parts A,B of 2)

### Ports
MAX_CS, SPI3 (harness SPI3)

### Harnesses
SPI3: SPI3_MISO, SPI3_MOSI, SPI3_SCK

### Nets
3V3: R13.2
5V: C39.2 C40.2 C41.2 R14.2 U7.3(DVDD) U7.21(AVDD) U7.24(PVDD)
GND: *.2(GND) *.4(GND) C39.1 C40.1 C41.1 P8.1 P9.1 R12.2 U7.4(DGND) U7.20(AGND) U7.23(PGND) U7.29(PGND)
VCAM: P8.2 P9.2
MAX_CS: R13.1 U7.8(CS) ; port MAX_CS
SPI3_MISO: U7.11(SDOUT) ; port SPI3.SPI3_MISO
SPI3_MOSI: U7.9(SDIN) ; port SPI3.SPI3_MOSI
SPI3_SCK: U7.10(SCLK) ; port SPI3.SPI3_SCK
Video_IN: C33.2 P8.3 R12.1
Video_OUT: P9.3 R15.2
Net*_1: *.1(IN) U7.6(XFB)
Net*_3: *.3(OUT) U7.5(CLKIN)
NetC33_1: C33.1 U7.22(VIN)
NetC34_1: C34.1 U7.25(SAG)
NetC34_2: C34.2 C35.2 R15.1
NetC35_1: C35.1 U7.26(VOUT)
NetR14_1: R14.1 U7.19(RESET)

Not connected (* = marked no-connect by the designer): U7 7(CLKOUT) 12(LOS) 17(VSYNC) 18(HSYNC)

### Library data of the parts
* = TSX-3225
C33 = CMP-1035-02589-1: CAP 100nF 25V ±20% 0603 (1608 Metric) Thickness 1mm SMD; Case-EIA: 0603; Tolerance: Â±20%; Case-Metric: 1608; Value: 100nF; Max Thickness: 1 mm; Technology: SMT; Rated Voltage: 25 V
C34 C35 = CMP-1037-05003-1: CAP 47uF 16V ±20% 1206 (3216 Metric) Thickness 1.9mm SMD; Tolerance: Â±20%; Case-EIA: 1206; Case-Metric: 3216; Value: 47uF; Max Thickness: 1.9 mm; Rated Voltage: 16 V; Technology: SMT
C39-C41 = CMP-1034-02075-1: as C7 on sheet mcu; Max Thickness: 0.6 mm; Value: 100nF; Technology: SMT; Rated Voltage: 35 V
R12 = CMP-1012-00047-1: 75R 0.1W 5% 0603 (1608 Metric)  SMD; Case-EIA: 0603; Value: 75.00 Ohm; Case-Metric: 1608; Technology: SMT; Tolerance: 5 %; Power: 0.1 W
R13 R14 = CMP-1011-00098-1: as R16 on sheet connectors; Technology: SMT; Tolerance: 5 %; Power: 0.063 W
R15 = CMP-1011-00047-1: 75R 0.063W 5% 0402 (1005 Metric)  SMD; Value: 75.00 Ohm; Case-Metric: 1005; Case-EIA: 0402; Power: 0.063 W; Tolerance: 5 %; Technology: SMT

## Nets that join several sheets
3V3: mcu (19 pins), mems (9 pins), powersupply (C31.2 C44.2 TP4.1 U6.5), connectors (U3.5 U10.8), usd (7 pins), osd (R13.2)
3V3_MEMS: mems (C15.1 C17.1 U8.16), powersupply (C46.2 C47.2 TP5.1 U12.5)
5V: mcu (P10.1 P11.2), powersupply (14 pins), connectors (7 pins), osd (7 pins)
GND: mcu (25 pins), mems (16 pins), powersupply (25 pins), connectors (23 pins), usd (C32.6 C32.9 C32.10 C32.11), osd (12 pins)
VCAM: powersupply (R23.2), osd (P8.2 P9.2)
VIn: powersupply (7 pins), connectors (D3.2 IC1.3 R18.1)
ICM_CS: mcu (U1.25), mems (U8.5)
ICM_INT: mcu (U1.24), mems (U8.6)
INV_SBUS: mcu (U1.34), connectors (R16.1 U3.1)
LPS_CS: mcu (U1.61), mems (U4.6)
LPS_INT: mcu (U1.2), mems (U4.7)
MAG_CS: mcu (U1.4), mems (U9.4)
MAG_DRDY: mcu (U1.11), mems (U9.15)
MAX_CS: mcu (U1.8), osd (R13.1 U7.8)
MOTOR1: mcu (U1.16), connectors (P1.2)
MOTOR2: mcu (U1.17), connectors (P2.2)
MOTOR3: mcu (U1.41), connectors (P3.2)
MOTOR4: mcu (U1.43), connectors (P4.2)
MOTOR5: mcu (U1.26), connectors (P5.2)
MOTOR6: mcu (U1.27), connectors (P6.2)
SD_DETECT: mcu (U1.36), usd (C32.12 R1.5)
SDIO_CMD: mcu (U1.54), usd (C32.3 R1.8)
SDIO_D0: mcu (U1.39), usd (C32.7 R2.1)
SDIO_D1: mcu (U1.40), usd (C32.8 R3.1)
SDIO_D2: mcu (U1.51), usd (C32.1 R1.6)
SDIO_D3: mcu (U1.52), usd (C32.2 R1.7)
SDIO_SCK: mcu (U1.53), usd (C32.5)
SPI1_MISO: mcu (U1.22), mems (U8.4)
SPI1_MOSI: mcu (U1.23), mems (U8.3)
SPI1_SCK: mcu (U1.21), mems (U8.2)
SPI3_MISO: mcu (U1.56), mems (U4.5 U9.5), osd (U7.11)
SPI3_MOSI: mcu (U1.57), mems (U4.4 U9.16), osd (U7.9)
SPI3_SCK: mcu (U1.55), mems (U4.2 U9.1), osd (U7.10)
UART1_RX: mcu (U1.59), connectors (C2.3)
UART1_TX: mcu (U1.58), connectors (C2.2)
UART3_INV: mcu (U1.33), connectors (R17.1 U10.1 U10.5)
UART3_RX: mcu (U1.30), connectors (U10.3)
UART3_TX: mcu (U1.29), connectors (U10.2)
UART4_TX: mcu (U1.14), connectors (C1.2)
UART6_RX: mcu (U1.38), connectors (U3.4)
UART6_TX: mcu (U1.37), connectors (C4.2 P13.2)
USB_N: mcu (U1.44), connectors (R10.2)
USB_P: mcu (U1.45), connectors (R11.2)
USB_VBUS: mcu (U1.42), connectors (D1.1 F1.2)
VBAT: mcu (U1.9), connectors (R18.2 R19.1)
WS/UART4_RX: mcu (U1.15), connectors (C1.3)

## Assembly variants
Small uSD Connector: all parts fitted